# EAGLE design USBduino_Max (EAGLE 6.1)
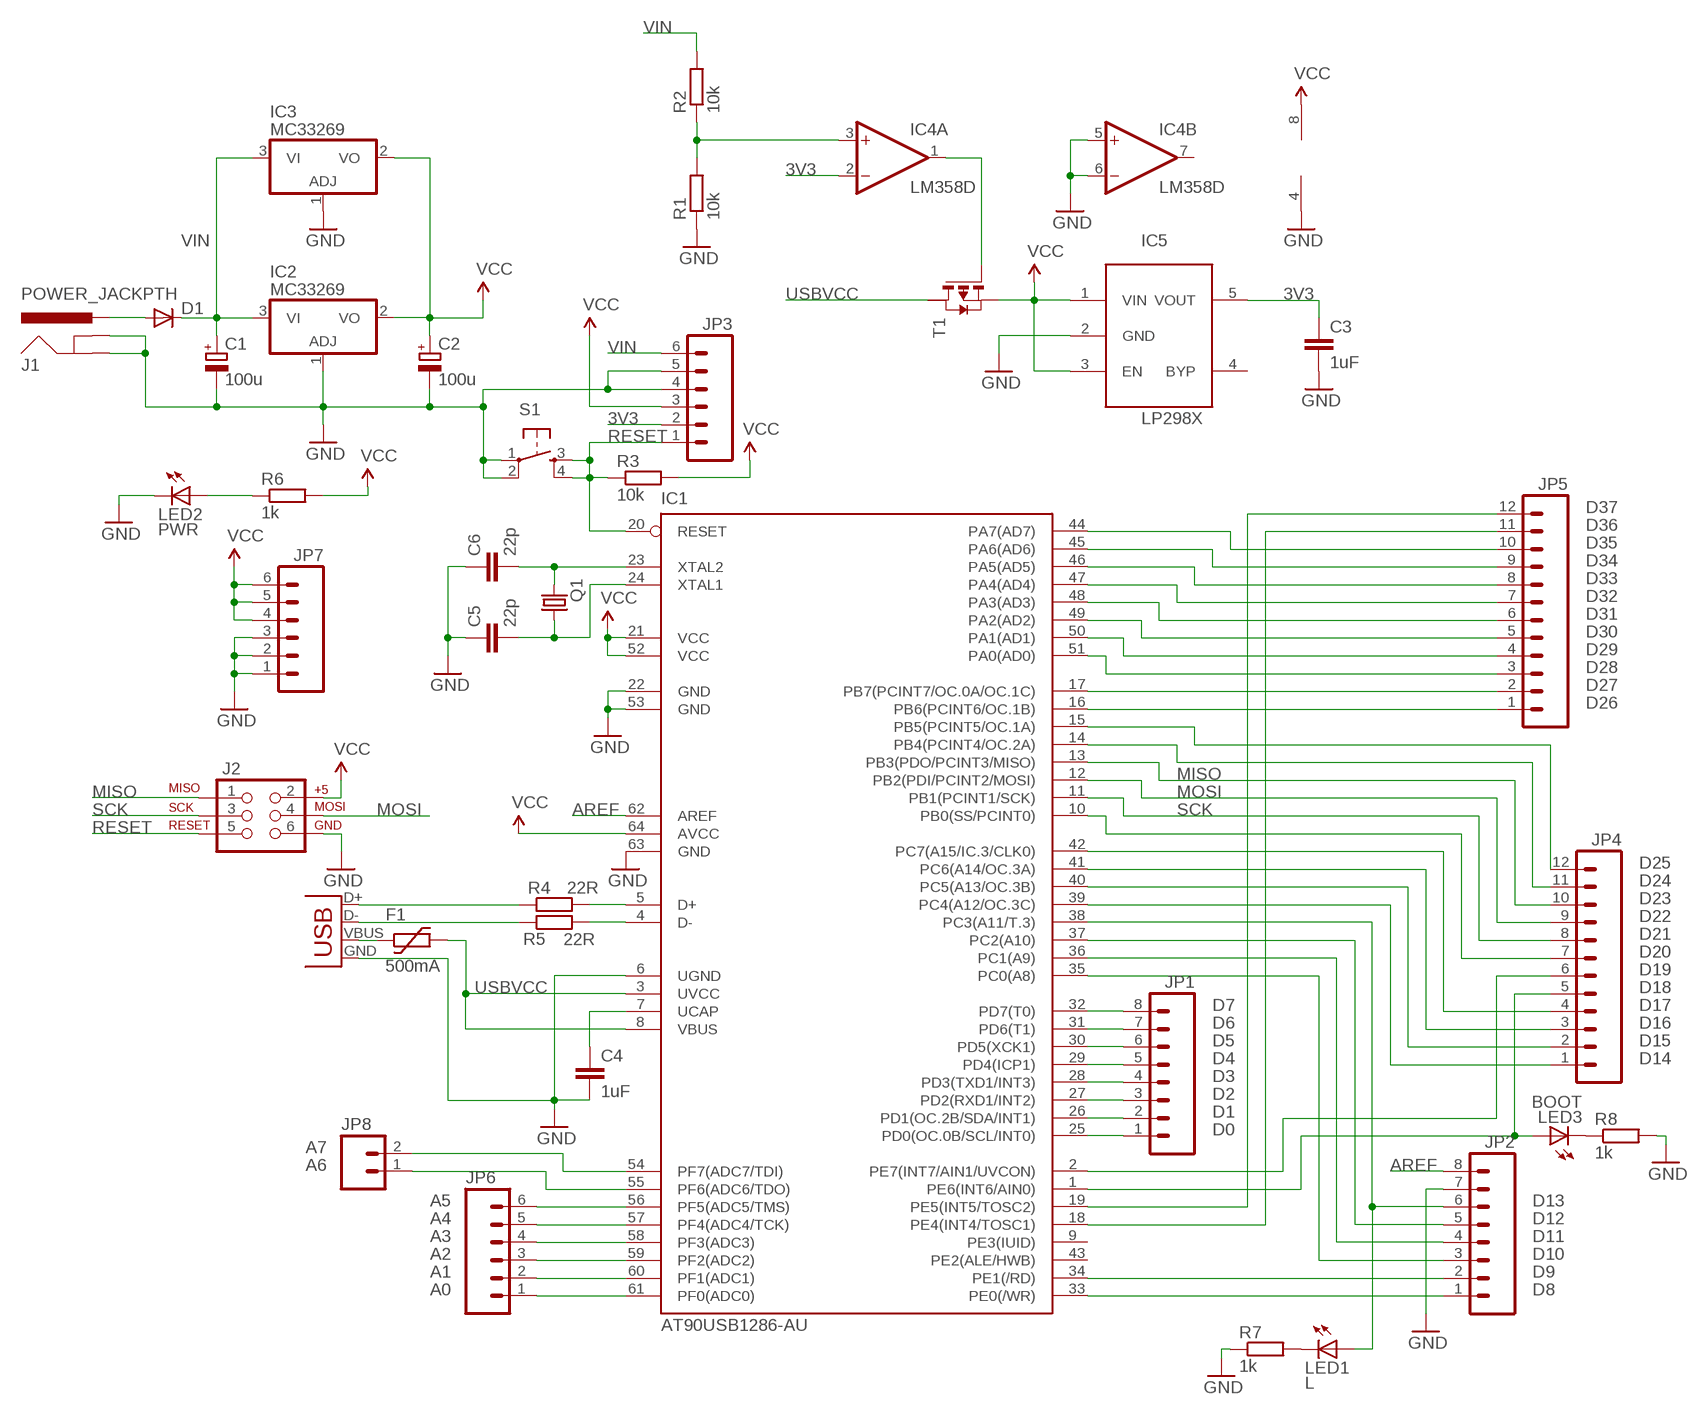
[diagram p0: schematic, sheet 1]

## Parts
C1  100u  CPOL-EUC  [PANASONIC_C]
C2  100u  CPOL-EUC  [PANASONIC_C]
C3  1uF  C-EUC0805  [C0805]
C4  1uF  C-EUC0805  [C0805]
C5  22p  C-EUC0805  [C0805]
C6  22p  C-EUC0805  [C0805]
D1  DIODE-SMB  [SMB]
F1  500mA  1812L  [1812L]
IC1  AT90USB1286-AU  AT90USB1287-AU  [TQFP64]
IC2  MC33269  MC33269D-5.0  [DPACK]
IC3  MC33269  MC33269D-5.0  [DPACK]
IC4  LM358D  [SO08]
IC5  LP2985  LP298XS  [SOT23-5L]
J1  POWER_JACKPTH  [POWER_JACK_PTH]
J2  AVR_SPI_PRG_6PTH  [2X3]
JP1  M08  [1X08]
JP2  M08  [1X08]
JP3  M06SIP  [1X06]
JP4  M12PTH  [1X12]
JP5  M12PTH  [1X12]
JP6  M06SIP  [1X06]
JP7  M06SIP  [1X06]
JP8  M02PTH  [1X02]
LED1  L  LED1206  [LED-1206]
LED2  PWR  LED1206  [LED-1206]
LED3  BOOT  LED1206  [LED-1206]
Q1  CRYSTALHC49S  [HC49/S]
R1  10k  R-EU_R0805  [R0805]
R2  10k  R-EU_R0805  [R0805]
R3  10k  R-EU_R0805  [R0805]
R4  22R  R-EU_R0805  [R0805]
R5  22R  R-EU_R0805  [R0805]
R6  1k  R-EU_R0805  [R0805]
R7  1k  R-EU_R0805  [R0805]
R8  1k  R-EU_R0805  [R0805]
S1  TAC_SWITCHPTH  [TACTILE-PTH]
T1  PMOSSOT223  [SOT223]
X1  USBPTH  [USB-B-PTH]

## Nets
3V3: C3.1 IC4.2(A:-IN) IC5.5(VOUT) JP3.2
AREF: IC1.62(AREF) JP2.8
GND: C1.- C2.- C3.2 C4.2 C5.1 C6.1 IC1.6(UGND) IC1.22(GND) IC1.53(GND) IC1.63(GND) IC2.1(ADJ) IC3.1(ADJ) IC4.4(P:V-) IC4.5(B:+IN) IC4.6(B:-IN) IC5.2(GND) J1.GND J1.GNDBREAK J2.6 JP2.7 JP3.4 JP3.5 JP7.1 JP7.2 JP7.3 LED2.C R1.1 R7.1 R8.2 S1.1 S1.2 X1.GND
MISO: IC1.13(PB3(PDO/PCINT3/MISO)) J2.1 JP4.10
MOSI: IC1.12(PB2(PDI/PCINT2/MOSI)) J2.4 JP4.9
N$1: IC4.3(A:+IN) R1.2 R2.1
N$2: D1.A J1.PWR
N$3: IC4.1(A:OUT) T1.1(G)
N$4: IC1.25(PD0(OC.0B/SCL/INT0)) JP1.1
N$5: IC1.26(PD1(OC.2B/SDA/INT1)) JP1.2
N$6: IC1.27(PD2(RXD1/INT2)) JP1.3
N$7: IC1.28(PD3(TXD1/INT3)) JP1.4
N$8: IC1.29(PD4(ICP1)) JP1.5
N$9: IC1.30(PD5(XCK1)) JP1.6
N$10: IC1.31(PD6(T1)) JP1.7
N$11: IC1.32(PD7(T0)) JP1.8
N$12: IC1.33(PE0(/WR)) JP2.1
N$13: IC1.34(PE1(/RD)) JP2.2
N$14: IC1.35(PC0(A8)) JP2.3
N$15: IC1.36(PC1(A9)) JP2.4
N$16: IC1.37(PC2(A10)) JP2.5
N$17: IC1.38(PC3(A11/T.3)) JP2.6 LED1.A
N$18: IC1.5(D+) R4.2
N$19: IC1.4(D-) R5.2
N$20: R5.1 X1.D-
N$21: R4.1 X1.D+
N$22: C6.2 IC1.23(XTAL2) Q1.2
N$23: C4.1 IC1.7(UCAP)
N$24: C5.2 IC1.24(XTAL1) Q1.1
N$25: F1.P$1 X1.VBUS
N$26: IC1.39(PC4(A12/OC.3C)) JP4.1
N$27: IC1.40(PC5(A13/OC.3B)) JP4.2
N$28: IC1.41(PC6(A14/OC.3A)) JP4.3
N$29: IC1.42(PC7(A15/IC.3/CLK0)) JP4.4
N$30: IC1.1(PE6(INT6/AIN0)) JP4.5 LED3.A
N$31: IC1.2(PE7(INT7/AIN1/UVCON)) JP4.6
N$32: IC1.10(PB0(SS/PCINT0)) JP4.7
N$33: LED2.A R6.1
N$34: LED1.C R7.2
N$35: LED3.C R8.1
N$36: IC1.14(PB4(PCINT4/OC.2A)) JP4.11
N$37: IC1.15(PB5(PCINT5/OC.1A)) JP4.12
N$38: IC1.16(PB6(PCINT6/OC.1B)) JP5.1
N$39: IC1.17(PB7(PCINT7/OC.0A/OC.1C)) JP5.2
N$40: IC1.51(PA0(AD0)) JP5.3
N$41: IC1.50(PA1(AD1)) JP5.4
N$42: IC1.49(PA2(AD2)) JP5.5
N$43: IC1.48(PA3(AD3)) JP5.6
N$44: IC1.47(PA4(AD4)) JP5.7
N$45: IC1.46(PA5(AD5)) JP5.8
N$46: IC1.45(PA6(AD6)) JP5.9
N$47: IC1.44(PA7(AD7)) JP5.10
N$48: IC1.18(PE4(INT4/TOSC1)) JP5.11
N$49: IC1.19(PE5(INT5/TOSC2)) JP5.12
N$50: IC1.61(PF0(ADC0)) JP6.1
N$51: IC1.60(PF1(ADC1)) JP6.2
N$52: IC1.59(PF2(ADC2)) JP6.3
N$53: IC1.58(PF3(ADC3)) JP6.4
N$54: IC1.57(PF4(ADC4/TCK)) JP6.5
N$55: IC1.56(PF5(ADC5/TMS)) JP6.6
N$56: IC1.55(PF6(ADC6/TDO)) JP8.1
N$57: IC1.54(PF7(ADC7/TDI)) JP8.2
RESET: IC1.20(RESET) J2.5 JP3.1 R3.1 S1.3 S1.4
SCK: IC1.11(PB1(PCINT1/SCK)) J2.3 JP4.8
USBVCC: F1.P$2 IC1.3(UVCC) IC1.8(VBUS) T1.2(D)
VCC: C2.+ IC1.21(VCC) IC1.52(VCC) IC1.64(AVCC) IC2.2(VO) IC3.2(VO) IC4.8(P:V+) IC5.1(VIN) IC5.3(EN) J2.2 JP3.3 JP7.4 JP7.5 JP7.6 R3.2 R6.2 T1.3(S)
VIN: C1.+ D1.C IC2.3(VI) IC3.3(VI) JP3.6 R2.2
Unconnected: IC1.9(PE3(IUID)) IC1.43(PE2(ALE/HWB)) IC4.7(B:OUT) IC5.4(BYP) T1.4(D2)

## Notes on the sheet
- D37
- D36
- D35
- D34
- D33
- D32
- D31
- D30
- D29
- D28
- D27
- D26
- D25
- D24
- D23
- D22
- D21
- D20
- D19
- D18
- D7 | D17
- D6 | D16
- D5 | D15
- D4 | D14
- D3
- D2
- D1
- D0
- A7
- A6
- A5 | D13
- A4 | D12
- A3 | D11
- A2 | D10
- A1 | D9
- A0 | D8

## Library data of the parts
C1 C2 = rcl:CPOL-EU: POLARIZED CAPACITOR, European symbol
C3-C6 = rcl:C-EU: CAPACITOR, European symbol
D1 = diode:DIODE-: DIODE
F1 = ptc-littlefuse:1812L
IC1 = at90usb:AT90USB1287-*: Atmel AT90USB1287 AVR Microcontroller with USB Interface and 128kB Flash Memory
IC2 IC3 = linear:MC33269?*: Adjustable Output Low Dropout Voltage Regulator 800 mA Source: http://www.onsemi.com/pub/Collateral/MC33269-D.PDF
IC4 = linear:LM358: OP AMP also LM158; LM258; LM2904 Source: http://cache.national.com/ds/LM/LM158.pdf
IC5 = adafruit:LP298X
J1 = SparkFun:POWER_JACK: Power Jack This is the standard 5.5mm barrel jack for power. The PTH is the most common, proven, reliable, footprint. All others are experimental. The Slot footprint only works if the mill layer is transmitted to the PCB fab house so be warned. Spark Fun Electronics SKU : PRT-00119. Mating wall wart : TOL-00298 (and others)
J2 = SparkFun:AVR_SPI_PRG_6: AVR ISP 6 Pin This is the reduced ISP connector for AVR programming. Common on Arduino. This footprint will take up less PCB space and can be used with a 10-pin to 6-pin adapter such as SKU: BOB-08508
JP1 JP2 = SparkFun:M08: Header 8 Standard 8-pin 0.1" header. Use with straight break away headers (SKU : PRT-00116), right angle break away headers (PRT-00553), swiss pins (PRT-00743), machine pins (PRT-00117), and female headers (PRT-00115).
JP3 JP6 JP7 = SparkFun:M06: Header 6 Standard 6-pin 0.1" header. Use with straight break away headers (SKU : PRT-00116), right angle break away headers (PRT-00553), swiss pins (PRT-00743), machine pins (PRT-00117), and female headers (PRT-00115). Molex polarized connector foot print use with SKU : PRT-08094 with associated crimp pins and housings. NOTES ON THE VARIANTS LOCK and LOCK_LONGPADS... This footprint was designed to help hold the alignment of a through-hole component (i.e. 6-pin header) while soldering it into place. You may notice that each hole has been shifted either up or down by 0.005 of an inch from it's more standard position (which is a perfectly straight line). This slight alteration caused the pins (the squares in the middle) to touch the edges of the holes. Because they are alternating, it causes a "brace" to hold the component in place. 0.005 has proven to be the perfect amount of "off-center" position when using our standard breakaway headers. Although looks a little odd when you look at the bare footprint, once you have a header in there, the alteration is very hard to notice. Also, if you push a header all the way into place, it is covered up entirely on the bottom side. This idea of altering the position of holes to aid alignment will be further integrated into the Sparkfun Library for other footprints. It can help hold any component with 3 or more connection pins.
JP4 JP5 = SparkFun:M12: Header 12 Standard 12-pin 0.1" header. Use with straight break away headers (SKU : PRT-00116), right angle break away headers (PRT-00553), swiss pins (PRT-00743), machine pins (PRT-00117), and female headers (PRT-00115).
JP8 = SparkFun:M02: Header 2 Standard 2-pin 0.1" header. Use with straight break away headers (SKU : PRT-00116), right angle break away headers (PRT-00553), swiss pins (PRT-00743), machine pins (PRT-00117), and female headers (PRT-00115). Molex polarized connector foot print use with SKU : PRT-08233 with associated crimp pins and housings.
LED1-LED3 = SparkFun:LED: LEDs Standard schematic elements and footprints for 5mm, 3mm, 1206, and 0603 sized LEDs. 5mm - Spark Fun Electronics SKU : COM-00529 (and others)
Q1 = crystal:CRYSTAL: CRYSTAL; OC_FARNELL: 1667008; OC_NEWARK: unknown
R1-R8 = rcl:R-EU_: RESISTOR, European symbol
S1 = SparkFun:TAC_SWITCH: Momentary Switch Button commonly used for reset or general input. Spark Fun Electronics SKU : COM-00097
T1 = zetex:PMOSSOT223: MOS FET; OC_FARNELL: unknown; OC_NEWARK: unknown
X1 = SparkFun:USB: USB Connectors USB-B-PTH is fully proven SKU : PRT-00139 USB-miniB is fully proven SKU : PRT-00587 USB-A-PCB is untested. USB-A-H is throughly reviewed, but untested. Spark Fun Electronics SKU : PRT-00437 USB-B-SMT is throughly reviewed, but untested. Needs silkscreen touching up. USB-A-S has not been used/tested USB-MB-H has not been used/tested

## Board
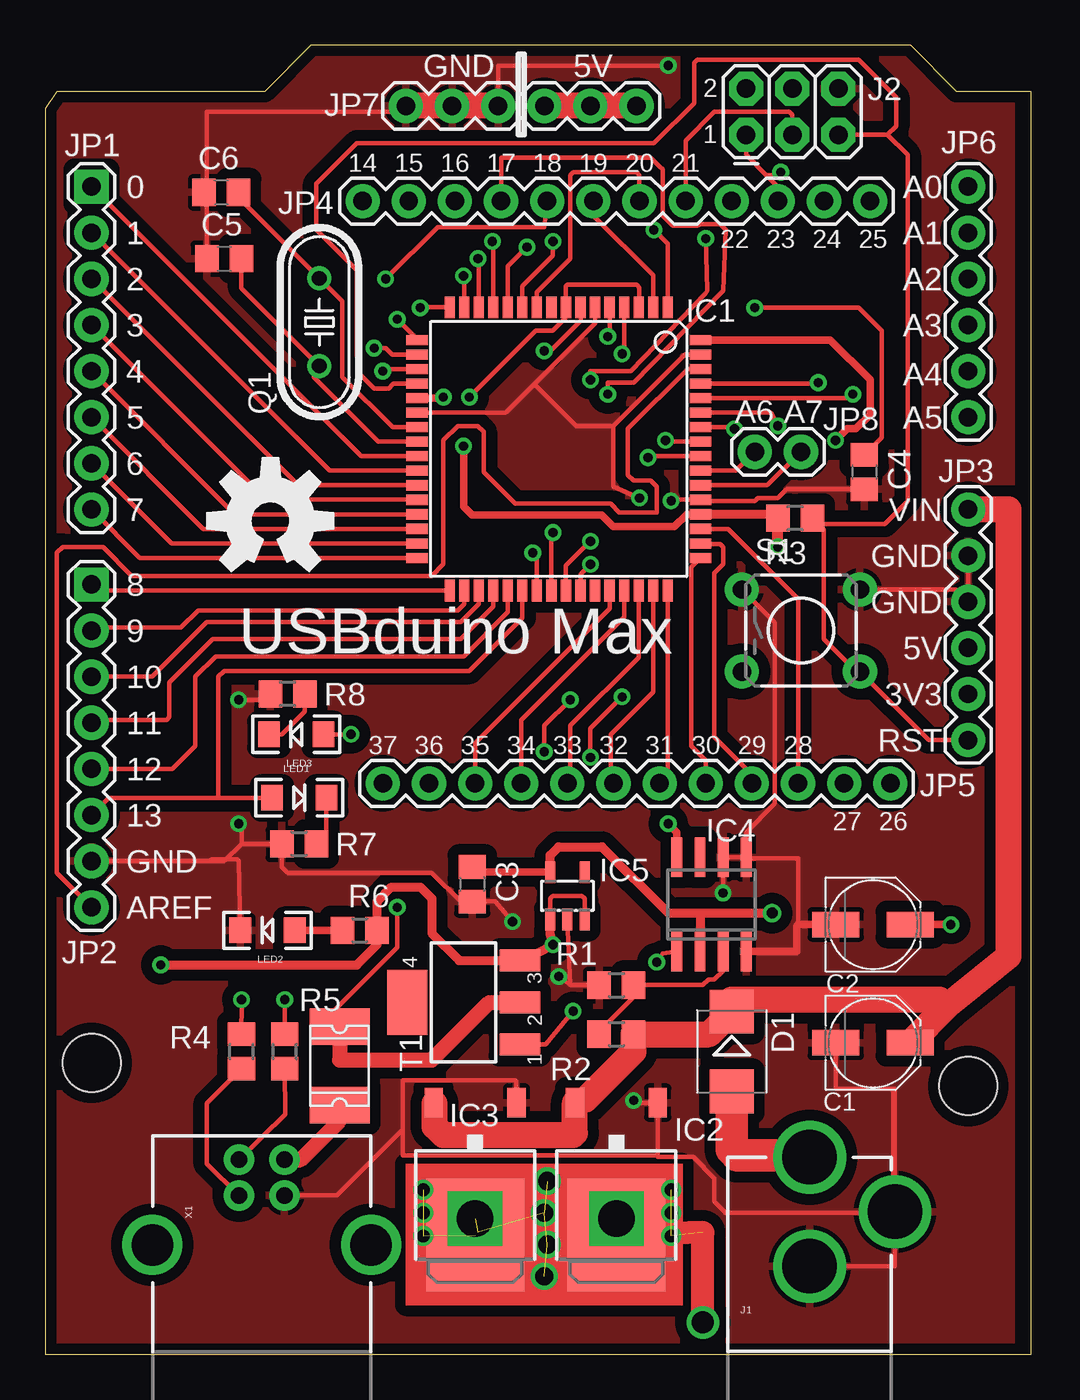
[diagram p1: board, top side]
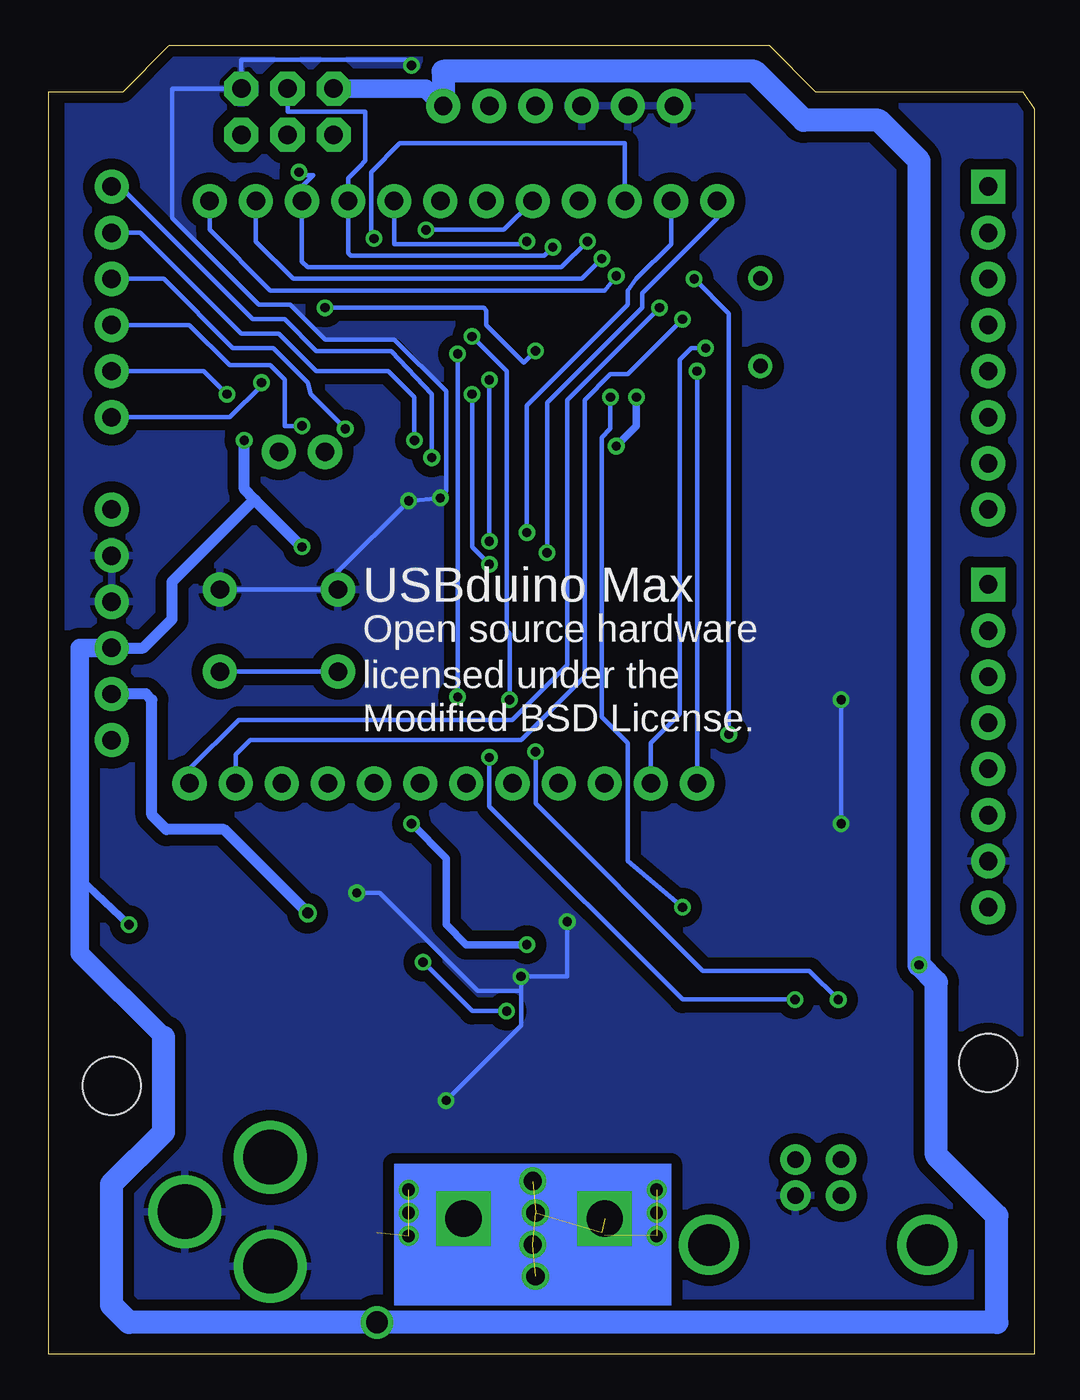
[diagram p2: board, bottom side, seen from below]

Size 54.27 x 72.07 mm. Coordinates in mm from the lower left corner, seen from the top.
Outline: 0,0 54.27,0 54.27,69.52 50.17,69.53 47.63,72.07 14.61,72.07 12.07,69.53 0.64,69.53 0,68.58 0,0
Copper layers (1*16): Top 0.035mm / dielectric 1.5mm / Bottom 0.035mm
Design rules: minimum track width 10mil, minimum drill 13mil, track to track 8mil, track to pad 8mil, pad to pad 8mil, via to via 8mil, smd to smd 8mil, copper to edge 15mil, drill to drill 8mil, minimum pad ring 10mil, minimum via ring 8mil, stop-mask expansion 4mil, vias tented up to drill 0mil, thermal gap 10mil
Holes 3.2 mm at 2.54,16.03 50.8,14.76

### Footprints (pad centres in the part's own frame; a part is rotated, then mirrored left to right if it is on the bottom)
PANASONIC_C = smd 2.6 x 1.4: + 2.05,0; - -2.05,0
C0805 = smd 1.3 x 1.5: 1 -0.95,0; 2 0.95,0
SMB = smd 2.4 x 2.4: A 2.2,0; C -2.2,0
1812L = smd 2.03 x 3.3: P$1 -2.16,0; P$2 2.16,0
TQFP64 = smd 1.194 x 0.559: 1 -7.8,6; 2 -7.8,5.2; 3 -7.8,4.4; 4 -7.8,3.6; 5 -7.8,2.8; 6 -7.8,2; 7 -7.8,1.2; 8 -7.8,0.4; 9 -7.8,-0.4; 10 -7.8,-1.2; 11 -7.8,-2; 12 -7.8,-2.8; 13 -7.8,-3.6; 14 -7.8,-4.4; 15 -7.8,-5.2; 16 -7.8,-6; 33 7.8,-6; 34 7.8,-5.2; 35 7.8,-4.4; 36 7.8,-3.6; 37 7.8,-2.8; 38 7.8,-2; 39 7.8,-1.2; 40 7.8,-0.4; 41 7.8,0.4; 42 7.8,1.2; 43 7.8,2; 44 7.8,2.8; 45 7.8,3.6; 46 7.8,4.4; 47 7.8,5.2; 48 7.8,6 | smd 0.559 x 1.194: 17 -6,-7.8; 18 -5.2,-7.8; 19 -4.4,-7.8; 20 -3.6,-7.8; 21 -2.8,-7.8; 22 -2,-7.8; 23 -1.2,-7.8; 24 -0.4,-7.8; 25 0.4,-7.8; 26 1.2,-7.8; 27 2,-7.8; 28 2.8,-7.8; 29 3.6,-7.8; 30 4.4,-7.8; 31 5.2,-7.8; 32 6,-7.8; 49 6,7.8; 50 5.2,7.8; 51 4.4,7.8; 52 3.6,7.8; 53 2.8,7.8; 54 2,7.8; 55 1.2,7.8; 56 0.4,7.8; 57 -0.4,7.8; 58 -1.2,7.8; 59 -2,7.8; 60 -2.8,7.8; 61 -3.6,7.8; 62 -4.4,7.8; 63 -5.2,7.8; 64 -6,7.8
DPACK = smd 1 x 1.6: 1 -2.28,-4.8; 3 2.28,-4.8 | smd 5.4 x 6.2: 2 0,2.5
SO08 = smd 0.6 x 2.2: 1 -1.905,-2.6; 2 -0.635,-2.6; 3 0.635,-2.6; 4 1.905,-2.6; 5 1.905,2.6; 6 0.635,2.6; 7 -0.635,2.6; 8 -1.905,2.6
SOT23-5L = smd 0.55 x 1.2: 1 -0.95,-1.3; 2 0,-1.3; 3 0.95,-1.3; 4 0.95,1.3; 5 -0.95,1.3
POWER_JACK_PTH = drill 2.997: GND 0,7.7; GNDBREAK 4.7,10.7; PWR 0,13.7
2X3 = drill 1.016 pad 1.88 octagon: 1 0,0; 2 0,2.54; 3 2.54,0; 4 2.54,2.54; 5 5.08,0; 6 5.08,2.54
1X08 = drill 1.016 pad 1.88 square: 1 0,0 | drill 1.016 pad 1.88: 2 2.54,0; 3 5.08,0; 4 7.62,0; 5 10.16,0; 6 12.7,0; 7 15.24,0; 8 17.78,0
1X06 = drill 1.016 pad 1.88: 1 0,0; 2 2.54,0; 3 5.08,0; 4 7.62,0; 5 10.16,0; 6 12.7,0
1X12 = drill 1.016 pad 1.88: 1 0,0; 2 2.54,0; 3 5.08,0; 4 7.62,0; 5 10.16,0; 6 12.7,0; 7 15.24,0; 8 17.78,0; 9 20.32,0; 10 22.86,0; 11 25.4,0; 12 27.94,0
1X02 = drill 1.016 pad 1.88: 1 0,0; 2 2.54,0
LED-1206 = smd 1.2 x 1.4: A -1.5,0; C 1.5,0
HC49/S = drill 0.813: 1 -2.413,0; 2 2.413,0
R0805 = smd 1.3 x 1.5: 1 -0.95,0; 2 0.95,0
TACTILE-PTH = drill 1.016 pad 1.88: 1 -3.251,2.261; 2 3.251,2.261; 3 -3.251,-2.261; 4 3.251,-2.261
SOT223 = smd 1.219 x 2.235: 1 -2.311,-3.099; 2 0,-3.099; 3 2.311,-3.099 | smd 3.6 x 2.2: 4 0,3.099
USB-B-PTH = drill 0.914 pad 1.676: D+ 0,1.25; D- 1.981,1.25; GND 0,-1.25; VBUS 1.981,-1.25 | drill 2.286: P$1 -2.718,-6.02; P$2 -2.718,6.02

### Placement (x,y rotation side)
C1  45.56,17.14 0 top
C2  45.56,23.65 0 top
C3  23.5,25.88 270 top
C4  45.08,48.58 270 top
C5  9.84,60.32 0 top
C6  9.68,63.98 0 top
D1  37.78,16.67 270 top
F1  16.19,15.87 90 top
IC1  28.26,49.85 270 top
IC2  31.43,9.05 180 top
IC3  23.65,9.05 180 top
IC4  36.67,24.76 0 top
IC5  28.73,25.24 0 top
J1  42.07,-2.86 0 top
J2  38.58,67.15 0 top
JP1  2.54,64.29 270 top
JP2  2.54,42.39 270 top
JP3  50.8,33.81 90 top
JP4  17.46,63.5 0 top
JP5  46.51,31.43 180 top
JP6  50.8,51.59 90 top
JP7  19.84,68.74 0 top
JP8  39.05,49.69 0 top
LED1  13.97,30.64 0 top
LED2  12.22,23.34 180 top
LED3  13.81,34.13 180 top
Q1  15.08,56.83 90 top
R1  31.43,20.32 0 top
R2  31.43,17.62 0 top
R3  41.28,46.04 180 top
R4  10.79,16.67 90 top
R5  13.18,16.67 90 top
R6  17.3,23.34 0 top
R7  13.97,28.1 0 top
R8  13.34,36.35 180 top
S1  41.59,39.85 0 top
T1  23.02,19.37 90 top
U$1  [OSHW-LOGO-L]  12.38,45.88 0 top
X1  11.91,8.73 90 top

### Tracks (layer width: path | path; a pad name or v marks a point on that pad's centre or on a via)
3V3  (via drill 0.6)
  Top 0.406: IC5.5 23.78,26.54 C3.1
  Top 0.508: IC4.2 36.04,24.13 36.2,24.29 | 36.2,24.29 v40.01,24.29 | IC5.5 27.78,27.47 28.26,27.94 30.64,27.94 34.29,24.29 36.2,24.29
  Bottom 0.61: JP3.2 48.9,36.35 48.58,36.04 48.58,29.69 47.78,28.89 44.61,28.89 v40.01,24.29
AREF
  Top 0.254: IC1.62 35.36,54.25 32.07,50.96 32.07,48.42 32.39,48.1 33.34,48.1 33.66,47.78 33.66,46.35 31.59,46.35 31.12,46.83 25.88,46.83 24.13,48.58 24.13,50.8 23.81,51.12 22.7,51.12 21.91,50.32 21.91,43.5 21.27,42.86 4.76,42.86 3.18,44.45 0.95,44.45 0.64,44.13 0.64,26.51 JP2.8
GND  (via drill 0.51)
  Top 0.254: JP3.5 JP3.4 50.13,42.11 S1.2 | 8.89,63.82 C5.1 | 8.89,63.82 C6.1 | v34.45,46.99 34.51,47.05 IC1.53 36.12,46.99 39.05,46.99 39.21,47.15 40.32,47.15 40.8,47.63 C4.2 | IC1.22 25.34,51.85 26.83,53.34 | IC1.6 30.26,56.77 26.83,53.34 | 9.05,27.15 JP2.7 | 9.05,27.15 9.84,27.15 10.8,28.1 | 10.8,28.1 R7.1 13.02,26.83 13.34,26.51 21.27,26.51 22.86,24.92 C3.2 24.76,24.93 v25.72,23.81 | R8.2 12.39,36.03 v10.64,36.04 | 10.8,28.1 10.8,29.05 v10.64,29.21 | 8.89,63.82 8.89,68.42 19.53,68.42 JP7.1 | IC1.63 35.2,55.05 31.27,51.12 | 31.27,51.12 31.27,47.78 v32.7,47.15 | JP7.3 24.92,70.96 v34.29,70.96 | 26.83,53.34 26.99,53.34 29.21,51.12 31.27,51.12 | C2.- 43.5,23.65 41.43,23.65 41.43,27.3 38.64,27.3 IC4.5 | IC4.6 IC4.5 | LED2.C 10.64,27.15 10.57,27.23 9.14,27.23 9.05,27.15 | R1.1 28.89,20.32 | 28.89,20.32 IC5.2 28.89,20.32 | IC4.5 38.58,28.73 40.16,30.32 40.16,40.28 S1.1 | X1.GND 16.03,8.73 19.69,12.38 | 19.69,12.38 19.69,15.08 25.88,15.08 25.93,15.02 IC3.1 | 19.69,12.38 19.69,10.95 33.66,10.95 33.71,10.85 | 33.71,10.85 IC2.1 32.58,13.85 v32.39,13.97 | v28.26,20.8 28.89,20.32 | v37.31,25.4 IC4.6 | IC4.6 | J1.GND 46.77,4.84 J1.GNDBREAK 46.77,14.6 46.67,14.6 | 43.5,14.6 43.5,17.14 C1.- 43.51,14.62 43.5,14.6 | 46.67,14.6 43.5,14.6 | 46.67,14.6 46.67,7.78 37.47,7.78 | 33.71,10.85 35.66,10.85 36.83,9.68 36.83,8.41 37.47,7.78 | 37.47,7.78 37.42,7.78
  Top 0.406: IC4.4 41.37,22.16 41.37,23.59 41.43,23.65 43.5,23.65 43.5,23.64 C2.-
  Top 1.422: JP7.3 JP7.2 JP7.1
  Bottom 0.254: S1.2 S1.1 38.34,43.1 v34.45,46.99 v32.7,47.15 32.49,47.36 32.55,47.36 32.39,47.52 32.39,53.02 35.24,55.88 39.05,55.88 40.96,57.78 42.7,57.78 47.47,62.55 47.47,69.69 J2.6 43.66,71.28 34.61,71.28 v34.29,70.96 | v10.64,29.21 v10.64,36.04 | v32.39,13.97 28.26,18.1 v28.26,20.8 | v28.26,20.8 | v28.26,20.8 | v25.72,23.81 25.72,20.8 v28.26,20.8 | v28.26,20.8 28.26,20 30.64,20 36.04,25.4 v37.31,25.4
  pour Top (isolate 0.61): 53.18,0.16 0.16,0.16 0.16,68.42 0.79,69.06 12.22,69.06 14.76,71.6 47.47,71.6 50.01,69.06 53.18,69.06
  pour Bottom (isolate 0.61): 53.18,69.06 53.18,0.16 0.16,0.16 0.16,68.42 0.79,69.06 12.22,69.06 14.76,71.6 47.47,71.6 50.01,69.06
MISO  (via drill 0.51)
  Top 0.254: J2.1 38.58,66.04 39.69,64.93 | 39.69,64.93 40.32,64.29 JP4.10 | 39.69,64.93 40.32,64.93 v40.48,65.09 | IC1.13 24.66,61.33 v24.61,61.28
  Bottom 0.254: v40.48,65.09 40.32,64.93 39.69,64.93 40.32,64.29 40.32,60.17 40.01,59.85 26.04,59.85 v24.61,61.28
MOSI  (via drill 0.51)
  Top 0.254: IC1.12 25.46,59.91 v26.51,60.96
  Bottom 0.254: J2.4 41.12,68.42 36.83,68.42 36.83,65.72 37.15,65.4 37.78,64.77 JP4.9 37.78,60.64 37.62,60.48 26.99,60.48 v26.51,60.96
N$1
  Top 0.254: R2.1 30.48,17.78 32.39,19.68 R1.2 36.2,20.32 36.51,20.64 36.83,20.64 37.31,21.11 IC4.3
N$2
  Top 1.016: 37.78,11.27 38.1,10.95 | 41.96,10.95 J1.PWR
  Top 1.778: 37.78,11.27 D1.A | 38.1,10.95 41.96,10.95
N$3  (via drill 0.51)
  Top 0.254: T1.1 27.53,17.06 v29.05,18.89 | IC4.1 33.97,22.07 v33.66,21.59
  Bottom 0.254: v29.05,18.89 30.96,18.89 v33.66,21.59 | v33.66,21.59
N$4
  Top 0.254: IC1.25 17.39,49.45 JP1.1
N$5
  Top 0.254: IC1.26 15.65,48.65 JP1.2
N$6
  Top 0.254: IC1.27 13.91,47.85 JP1.3
N$7
  Top 0.254: IC1.28 12.17,47.05 JP1.4
N$8
  Top 0.254: IC1.29 10.43,46.25 JP1.5
N$9
  Top 0.254: IC1.30 8.69,45.45 JP1.6
N$10
  Top 0.254: IC1.31 6.95,44.65 JP1.7
N$11
  Top 0.254: IC1.32 5.21,43.85 JP1.8
N$12
  Top 0.254: IC1.33 2.88,42.05 JP2.1
N$13
  Top 0.254: IC1.34 23.06,41.31 22.7,40.96 8.41,40.96 7.46,40 2.7,40 JP2.2
N$14
  Top 0.254: IC1.35 23.86,41.32 22.86,40.32 8.89,40.32 5.87,37.31 JP2.3
N$15
  Top 0.254: IC1.36 24.66,41.17 22.86,39.37 9.21,39.37 6.83,36.99 6.83,35.08 6.67,34.92 2.7,34.92 JP2.4
N$16
  Top 0.254: IC1.37 25.46,40.86 23.02,38.42 9.37,38.42 8.26,37.31 8.26,33.5 6.99,32.23 JP2.5
N$17
  Top 0.254: 9.53,30.64 3.49,30.64 JP2.6 | IC1.38 26.26,40.54 23.34,37.62 9.84,37.62 9.53,37.31 9.53,30.64 | 9.53,30.64 LED1.A
N$18  (via drill 0.51)
  Top 0.254: R4.2 10.8,19.37 v10.8,19.53 | v27.46,33.18 27.46,34.61 v28.89,36.04 | IC1.5 31.06,56.14 v30.96,56.04
  Bottom 0.254: v10.8,19.53 12.38,21.11 18.26,21.11 27.46,30.32 v27.46,33.18 | v28.89,36.04 28.89,39.69 29.05,39.85 29.05,54.13 v30.96,56.04
N$19  (via drill 0.51)
  Top 0.254: R5.2 13.18,19.37 v13.18,19.53 | v30,32.86 30,34.45 31.27,35.72 | 31.27,35.72 | 31.27,35.72 v31.75,36.19 | IC1.4 31.86,55.19 v31.75,55.09
  Bottom 0.254: v13.18,19.53 19.37,19.53 30,30.16 30,30.32 v30,32.86 | v31.75,36.19 v31.75,55.09
N$20
  Top 0.254: X1.D- 13.2,13.2 R5.1
N$21
  Top 0.254: X1.D+ 8.89,10.48 8.89,13.81 R4.1
N$22
  Top 0.254: IC1.23 19.12,51.05 16.35,53.82 16.35,57.98 Q1.2 10.63,63.69 C6.2
N$23  (via drill 0.51)
  Top 0.254: IC1.7 29.46,56.92 27.78,55.24 v27.46,55.24 | v39.05,57.63 44.77,57.63 46.04,56.36 46.04,50.48 C4.1
  Bottom 0.254: v27.46,55.24 27.62,55.09 28.1,54.61 30.16,56.67 30.16,57.47 30.32,57.63 v39.05,57.63
N$24
  Top 0.254: IC1.24 18.33,50.25 14.76,53.82 15.24,54.26 Q1.1 10.79,58.71 C5.2
N$25
  Top 0.813: X1.VBUS 14.05,10.71 16.19,12.86 F1.P$1
N$26  (via drill 0.51)
  Top 0.254: IC1.39 27.06,43.9 v26.83,44.13
  Bottom 0.254: JP4.1 17.46,62.55 21.59,58.42 21.59,57.63 26.83,52.39 v26.83,44.13
N$27  (via drill 0.51)
  Top 0.254: IC1.40 27.86,45.16 v27.94,45.24
  Bottom 0.254: JP4.2 20,61.12 21.91,59.21 22.38,58.58 22.38,57.78 27.94,52.23 v27.94,45.24
N$28  (via drill 0.51)
  Top 0.254: v36.35,61.44 36.43,58.58 36.35,58.42 | 36.35,58.42 | 36.35,58.42 | 36.35,58.42 | 36.35,58.42 32.23,54.13 30,54.13 v30,53.66 | IC1.41 28.66,43.42 v30,44.77
  Bottom 0.254: JP4.3 22.54,66.67 34.93,66.67 36.51,65.09 36.51,61.59 36.51,61.44 v36.35,61.44 | v30,44.77 v30,53.66 | v30,44.77
N$29  (via drill 0.51)
  Top 0.254: JP4.4 25.08,65.88 33.34,65.88 33.81,65.4 | 33.81,65.4 | 33.81,65.4 33.97,65.25 33.97,62.71 34.53,62.15 35.88,62.15 36.12,62.23 37.15,62.23 37.23,62.15 | 37.23,62.15 | 37.23,62.15 37.47,61.91 37.31,58.58 32.39,53.5 30.96,53.5 v30.96,52.86 | IC1.42 29.46,42.95 v30,43.5
  Bottom 0.254: v30.96,52.86 30.96,44.45 v30,43.5
N$30  (via drill 0.51)
  Top 0.254: IC1.1 34.26,61.15 v33.5,61.91 | LED3.A v16.83,34.13 | JP4.5 27.46,62.07 21.59,62.07 v18.73,59.21
  Bottom 0.254: JP4.5 | JP4.5 29.21,61.91 v33.5,61.91 | v16.83,34.13 16.83,57.31 v18.73,59.21
N$31
  Top 0.254: IC1.2 33.46,59.41 30.16,62.71 JP4.6
N$32
  Top 0.254: JP4.7 32.7,64.93 32.54,65.09 29.05,65.09 28.89,64.93 28.89,60.32 27.06,58.49 IC1.10
N$33
  Top 0.406: LED2.A R6.1
N$34
  Top 0.254: LED1.C 15.47,28.65 R7.2
N$35
  Top 0.254: R8.1 14.29,35.4 13.02,34.13 LED3.C
N$36  (via drill 0.51)
  Top 0.254: IC1.14 23.86,60.21 v23.81,60.32
  Bottom 0.254: JP4.11 42.86,61.28 40.8,59.21 24.92,59.21 v23.81,60.32
N$37  (via drill 0.51)
  Top 0.254: IC1.15 23.06,59.25 v23.02,59.37
  Bottom 0.254: JP4.12 45.4,61.91 42.07,58.58 23.65,58.58 v23.02,59.37
N$38  (via drill 0.51)
  Top 0.254: IC1.16 20.66,57.65 v20.64,57.63
  Bottom 0.254: JP5.1 46.51,32.23 43.82,34.92 28.73,34.92 25.72,37.94 25.72,52.55 v20.64,57.63
N$39  (via drill 0.51)
  Top 0.254: IC1.17 20.46,55.9 v19.37,56.99
  Bottom 0.254: JP5.2 43.97,33.02 43.18,33.81 28.26,33.81 24.77,37.31 24.77,52.55 23.34,53.97 22.38,53.97 v19.37,56.99 | v19.37,56.99
N$40
  Top 0.254: JP5.3 41.43,41.59 37.58,45.45 IC1.51
N$41
  Top 0.254: JP5.4 38.89,31.91 36.83,33.97 36.83,43.02 37.31,43.5 37.31,44.45 37.15,44.61 36.1,44.61 IC1.50
N$42
  Top 0.254: JP5.5 36.35,32.7 35.56,33.5 35.56,43.35 IC1.49
N$43
  Top 0.254: IC1.48 34.26,31.88 JP5.6
N$44
  Top 0.254: IC1.47 33.46,36.47 31.12,34.13 31.12,31.59 JP5.7
N$45
  Top 0.254: IC1.46 32.66,38.37 28.89,34.61 28.89,31.59 JP5.8
N$46
  Top 0.254: IC1.45 31.86,40.59 26.19,34.92 JP5.9
N$47
  Top 0.254: IC1.44 31.06,41.06 23.65,33.65 JP5.10
N$48  (via drill 0.51)
  Top 0.254: IC1.18 19.09,55.05 18.73,55.4 v18.1,55.4
  Bottom 0.254: JP5.11 21.11,33.65 19.53,35.24 19.53,54.77 18.89,55.4 v18.1,55.4
N$49  (via drill 0.51)
  Top 0.254: IC1.19 18.69,54.25 v18.57,54.13
  Bottom 0.254: JP5.12 v18.57,54.13 | v18.57,54.13
N$50  (via drill 0.51)
  Top 0.254: IC1.61 42.44,53.45 v42.55,53.5
  Bottom 0.254: JP6.1 44.29,51.59 42.55,53.34 v42.55,53.5
N$51  (via drill 0.51)
  Top 0.254: IC1.60 44.23,52.65 v44.45,52.86
  Bottom 0.254: JP6.2 45.72,54.13 v44.45,52.86
N$52  (via drill 0.51)
  Top 0.254: IC1.59 39.94,51.85 v40.32,51.12
  Bottom 0.254: JP6.3 46.51,56.67 44.29,54.45 42.07,54.45 41.28,53.66 41.28,51.12 v40.32,51.12
N$53  (via drill 0.51)
  Top 0.254: IC1.58 37.85,51.05 v37.94,50.96
  Bottom 0.254: JP6.4 47.94,59.21 44.13,55.4 41.91,55.4 40.01,53.5 39.85,52.86 v37.94,50.96
N$54  (via drill 0.51)
  Top 0.254: IC1.57 34.21,50.25 v34.13,50.32
  Bottom 0.254: JP6.5 49.21,61.75 43.66,56.2 41.59,56.2 39.53,54.13 35.56,54.13 34.13,52.7 v34.13,50.32
N$55  (via drill 0.51)
  Top 0.254: IC1.56 33.1,49.45 v33.18,49.37
  Bottom 0.254: JP6.6 50.32,64.29 43.02,56.99 41.28,56.99 39.53,55.24 35.4,55.24 33.18,52.86 v33.18,49.37
N$56
  Top 0.254: IC1.55 38.01,48.65 JP8.1
N$57
  Top 0.254: IC1.54 39.75,47.85 JP8.2
N$59  (via drill 2)
  other vias: 31.43,7.46
RESET
  Top 0.254: IC1.20 19.16,53.45 18.89,53.18 18.1,53.18 17.3,53.97 17.3,54.77 17.15,54.93 17.15,59.69 14.92,61.91 14.92,64.45 16.99,66.52 | 16.99,66.52 | 16.99,66.52 17.15,66.67 33.5,66.67 35.72,68.9 35.72,71.12 35.88,71.28 44.77,71.28 46.83,69.21 46.83,67.63 46.36,67.15 | 46.36,67.15 J2.5 | 46.36,67.15 | 46.36,67.15 47.47,66.04 47.47,46.99 46.2,45.72 42.54,45.72 R3.1 42.86,45.4 42.86,39.37 44.65,37.59 S1.4 48.62,33.81 JP3.1
  Bottom 0.254: S1.4 S1.3
SCK  (via drill 0.51)
  Top 0.254: J2.3 41.12,68.26 40.96,68.42 36.83,68.42 35.24,66.83 JP4.8 | IC1.11 26.26,58.8 27.94,60.48 v27.94,61.28
  Bottom 0.254: JP4.8 35.24,61.12 28.1,61.12 v27.94,61.28
USBVCC  (via drill 0.51)
  Top 0.254: IC1.3 32.7,57.69 32.7,58.74 32.54,58.9 28.73,58.9 28.66,58.82 IC1.8 28.66,57.07 27.94,56.36 26.99,56.36 v23.34,52.7 | F1.P$2 15.88,18.89 19.37,22.38 v19.37,24.61
  Top 0.813: F1.P$2 16.19,16.19 21.27,16.19 24.45,19.37 T1.2
  Bottom 0.254: v23.34,52.7 23.34,50.96 23.81,50.48 23.81,35.08 22.38,33.65 22.38,27.15 v19.37,24.61
VCC  (via drill 0.51, 0.7, 1, 1.2, 2)  (11 unrouted)
  Top 0.254: 40.12,46.25 R3.2 | v21.91,52.7 21.85,52.65 | IC5.3 29.68,25.08 29.53,25.24 27.94,25.24 27.78,25.08 IC5.1 | IC5.1 | R6.2 | 27.78,23.18 IC5.1
  Top 0.406: 21.85,52.65 IC1.21 | v23.02,50.01 23.02,46.67 23.5,46.2 30.64,46.2 31.27,45.56 34.61,45.56 35.29,46.25 IC1.52 | v49.85,23.65 C2.+ | C2.+ | IC1.64 43.21,55.85 45.4,53.66 45.4,51.75 44.61,50.96 44.13,50.96 v43.5,50.32 | IC4.8 34.77,28.73 v34.29,29.21
  Top 0.508: 40.12,46.25 IC1.52 | IC5.1 27.78,23.18 v27.94,22.54 26.28,21.68 T1.3 22.77,21.68 21.27,23.18 21.27,25.08 20.64,25.72 19.05,25.72 18.26,24.92 R6.2 | R6.2 18.25,22.54 17.15,21.43 v6.35,21.43
  Top 0.61: v40.32,44.45 R3.2
  Top 1.016: 23.81,6.71 IC3.2
  Top 1.27: v36.2,1.75 36.2,6.71 IC2.2 23.81,6.71
  Top 1.422: JP7.6 JP7.5 JP7.4
  Bottom 0.254: 42.94,47.07 42.86,46.99 43.02,46.99 42.94,47.07 | v6.35,21.43
  Bottom 0.406: v21.91,52.7 21.91,51.12 v23.02,50.01 | 52.55,26.19 v49.85,23.65 | v27.94,22.54 31.27,22.54 32.39,23.65 32.39,27.3 v34.29,29.21
  Bottom 0.61: 42.86,46.99 v40.32,44.45 | JP3.3 49.05,38.89 47.47,40.48 47.47,42.54 43.02,46.99 | v43.5,50.32 43.5,47.62 42.94,47.07
  Bottom 1.016: J2.2 33.5,69.69 JP7.6 | 2.06,1.75 | v36.2,1.75 31.75,1.75 | JP3.3 52.55,38.89 52.55,26.19 52.55,22.07 47.94,17.46
  Bottom 1.27: JP7.6 32.54,70.64 15.4,70.64 12.7,67.94 8.57,67.94 6.35,65.72 v6.35,21.43 5.4,20.48 5.4,10.95 2.06,7.62 2.06,1.75 | 2.06,1.75 v36.2,1.75 49.85,1.75 50.8,2.7 50.8,9.37 47.94,12.22 47.94,17.46
  other vias: 23.65,7.46 20.8,9.05 20.8,7.78 20.8,6.51 27.62,9.52 27.46,7.78 27.62,6.03 27.46,4.29 34.45,9.05 34.45,7.78 34.45,6.51
VIN
  Top 1.016: 49.21,19.53 49.6,19.14 | IC2.3 29.72,14.01 | R2.2 | 29.05,12.06 29.15,12.17 | 21.43,13.79 IC3.3
  Top 1.422: JP3.6 53.02,46.51 53.02,21.92 49.6,19.14 C1.+ | 49.21,19.53 37.78,19.53 D1.C 36.54,17.62 R2.2 | 29.72,14.01 32.39,16.67 R2.2 | 29.15,12.17 IC2.3 | 29.05,12.06 21.91,12.06 21.43,12.54 21.43,13.79
(copper drawn outside any net)
  shapes: Bottom area x1, Top area x3

### Text on the board
tPlace: GND | 5V | 2 | 1 | 14 | 15 | 16 | 17 | 18 | 19 | 20 | 21 | A0 | 0 | A1 | 1 | 22 | 23 | 24 | 25 | A2 | 2 | A3 | 3 | A4 | 4 | A5 | A6 | A7 | 5 | 6 | VIN | 7 | GND | GND | 8 | 9 | 5V | USBduino Max | 10 | 3V3 | 11 | RST | 37 | 36 | 35 | 34 | 33 | 32 | 31 | 30 | 29 | 28 | 12 | 27 | 26 | 13 | GND | AREF
bPlace: USBduino Max | Open source hardware | licensed under the | Modified BSD License.